# Altium project Transmitter.PrjPcb
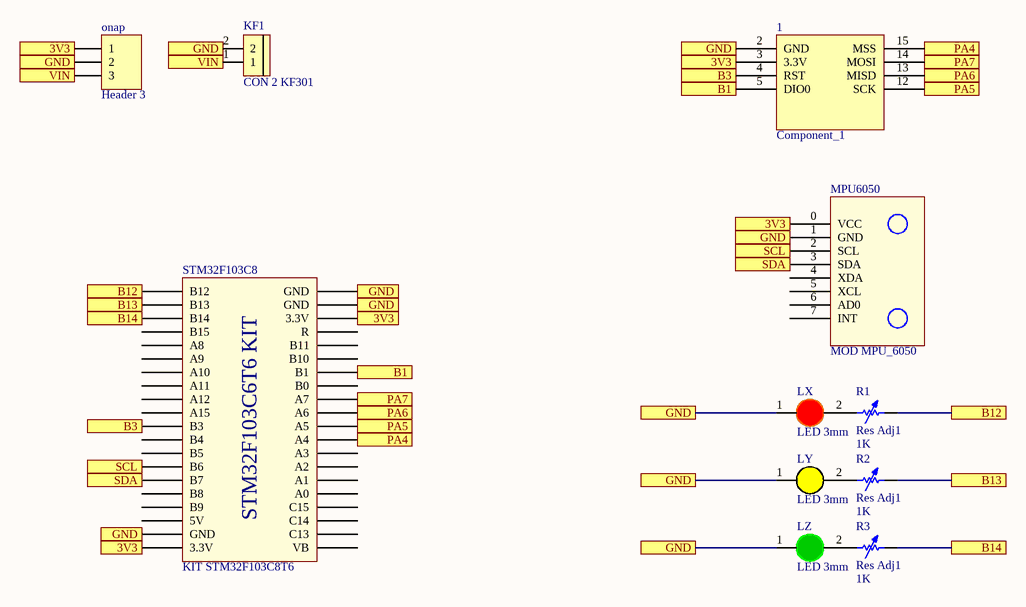
[diagram p0: Transmitter.SchDoc]
1 sheet, 11 parts. Net scope: flat (ports and power ports of the same name join across sheets).
Board file: Transmitter.PcbDoc

## Sheet Transmitter.SchDoc
size A; SheetNumber: 1; SheetTotal: 1

### Parts
1  Component_1  [DIP16 - duplicate1]
KF1  CON 2 KF301  [Con 2 KF301 5.08]
LX  LED 3mm  [LED-3MM-RED]
LY  LED 3mm  [LED-3MM-YELLOW]
LZ  LED 3mm  [LED-3MM-GREEN]
MPU6050  MOD MPU_6050  [MOD MPU-6050]
onap  Header 3  [HDR1X3]
R1  Res Adj1  value 1K  [AXIAL-0.7]
R2  Res Adj1  value 1K  [AXIAL-0.7]
R3  Res Adj1  value 1K  [AXIAL-0.7]
STM32F103C8  KIT STM32F103C8T6  [STM32F103 KIT]

### Ports
3V3, B1, B3, B12, B13, B14, GND, PA4, PA5, PA6, PA7, SCL, SDA, VIN

### Nets
Net1_2: 1.2(GND) KF1.2 LX.1(A) LY.1(A) LZ.1(A) MPU6050.1(GND) onap.2 STM32F103C8.19(GND) STM32F103C8.39(GND) STM32F103C8.40(GND) ; port GND
Net1_3: 1.3(3.3V) MPU6050.0(VCC) onap.1 STM32F103C8.20(3.3V) STM32F103C8.38(3.3V) ; port 3V3
Net1_4: 1.4(RST) STM32F103C8.11(B3) ; port B3
Net1_5: 1.5(DIO0) STM32F103C8.34(B1) ; port B1
Net1_12: 1.12(SCK) STM32F103C8.30(A5) ; port PA5
Net1_13: 1.13(MISD) STM32F103C8.31(A6) ; port PA6
Net1_14: 1.14(MOSI) STM32F103C8.32(A7) ; port PA7
Net1_15: 1.15(MSS) STM32F103C8.29(A4) ; port PA4
NetKF1_1: KF1.1 onap.3 ; port VIN
NetLX_2: LX.2(K) R1.1
NetLY_2: LY.2(K) R2.1
NetLZ_2: LZ.2(K) R3.1
NetMPU6050_2: MPU6050.2(SCL) STM32F103C8.14(B6) ; port SCL
NetMPU6050_3: MPU6050.3(SDA) STM32F103C8.15(B7) ; port SDA
NetR1_2: R1.2 STM32F103C8.1(B12) ; port B12
NetR2_2: R2.2 STM32F103C8.2(B13) ; port B13
NetR3_2: R3.2 STM32F103C8.3(B14) ; port B14

Not connected (* = marked no-connect by the designer): MPU6050 4(XDA) 5(XCL) 6(AD0) 7(INT); STM32F103C8 4(B15) 5(A8) 6(A9) 7(A10) 8(A11) 9(A12) 10(A15) 12(B4) 13(B5) 16(B8) 17(B9) 18(5V) 21(VB) 22(C13) 23(C14) 24(C15) 25(A0) 26(A1) 27(A2) 28(A3) 33(B0) 35(B10) 36(B11) 37(R)

### Notes on the sheet
- (in symbol STM32f103 Bluepill) STM32F103C6T6 KIT

### Library data of the parts
KF1 = CON 2 KF301: Cắm; Ma_Hang: MH000987; Ten_Linh_Kien: CON 2 KF301-2P 5.08MM Xanh Dương; Chung_Loai: Cắm; Ghi_Chu: *; Kieu_Chan: *; Don_Vi: Con
LX = LED 3mm Do: Cắm; Don_Vi: Con; Ma_Hang: MH003892; Ten_Linh_Kien: Led 3MM Phủ Đỏ (10c); Ghi_Chu: *; Kieu_Chan: *; Chung_Loai: Cắm
LY = LED 3mm Vang: Cắm; Don_Vi: Con; Ma_Hang: MH003893; Ten_Linh_Kien: Led 3MM Phủ Vàng (10c); Ghi_Chu: *; Kieu_Chan: *; Chung_Loai: Cắm
LZ = LED 3mm Xanh La: Cắm; Don_Vi: Con; Ma_Hang: MH001054; Ten_Linh_Kien: Led 3MM Phủ Xanh (10c); Ghi_Chu: *; Kieu_Chan: *; Chung_Loai: Cắm
onap = Header 3: Header, 3-Pin; LatestRevisionDate: 17-Jul-2002; LatestRevisionNote: Re-released for DXP Platform.; Publisher: Altium Limited
R1-R3 = Res Adj1: Variable Resistor; Set Position: 0.5; Published: 8-Jun-2000; LatestRevisionDate: 17-Jul-2002; LatestRevisionNote: Re-released for DXP Platform.; PackageReference: AXIAL-0.7; Publisher: Altium Limited; PackageDescription: Axial Device, Thru-Hole; 2 Leads; 0.7 in Pin Spacing
STM32F103C8 = STM32f103 Bluepill: KIT STM32F103C8T6 Bluepill